# EAGLE design imp_rev1 (EAGLE 7.7.0)
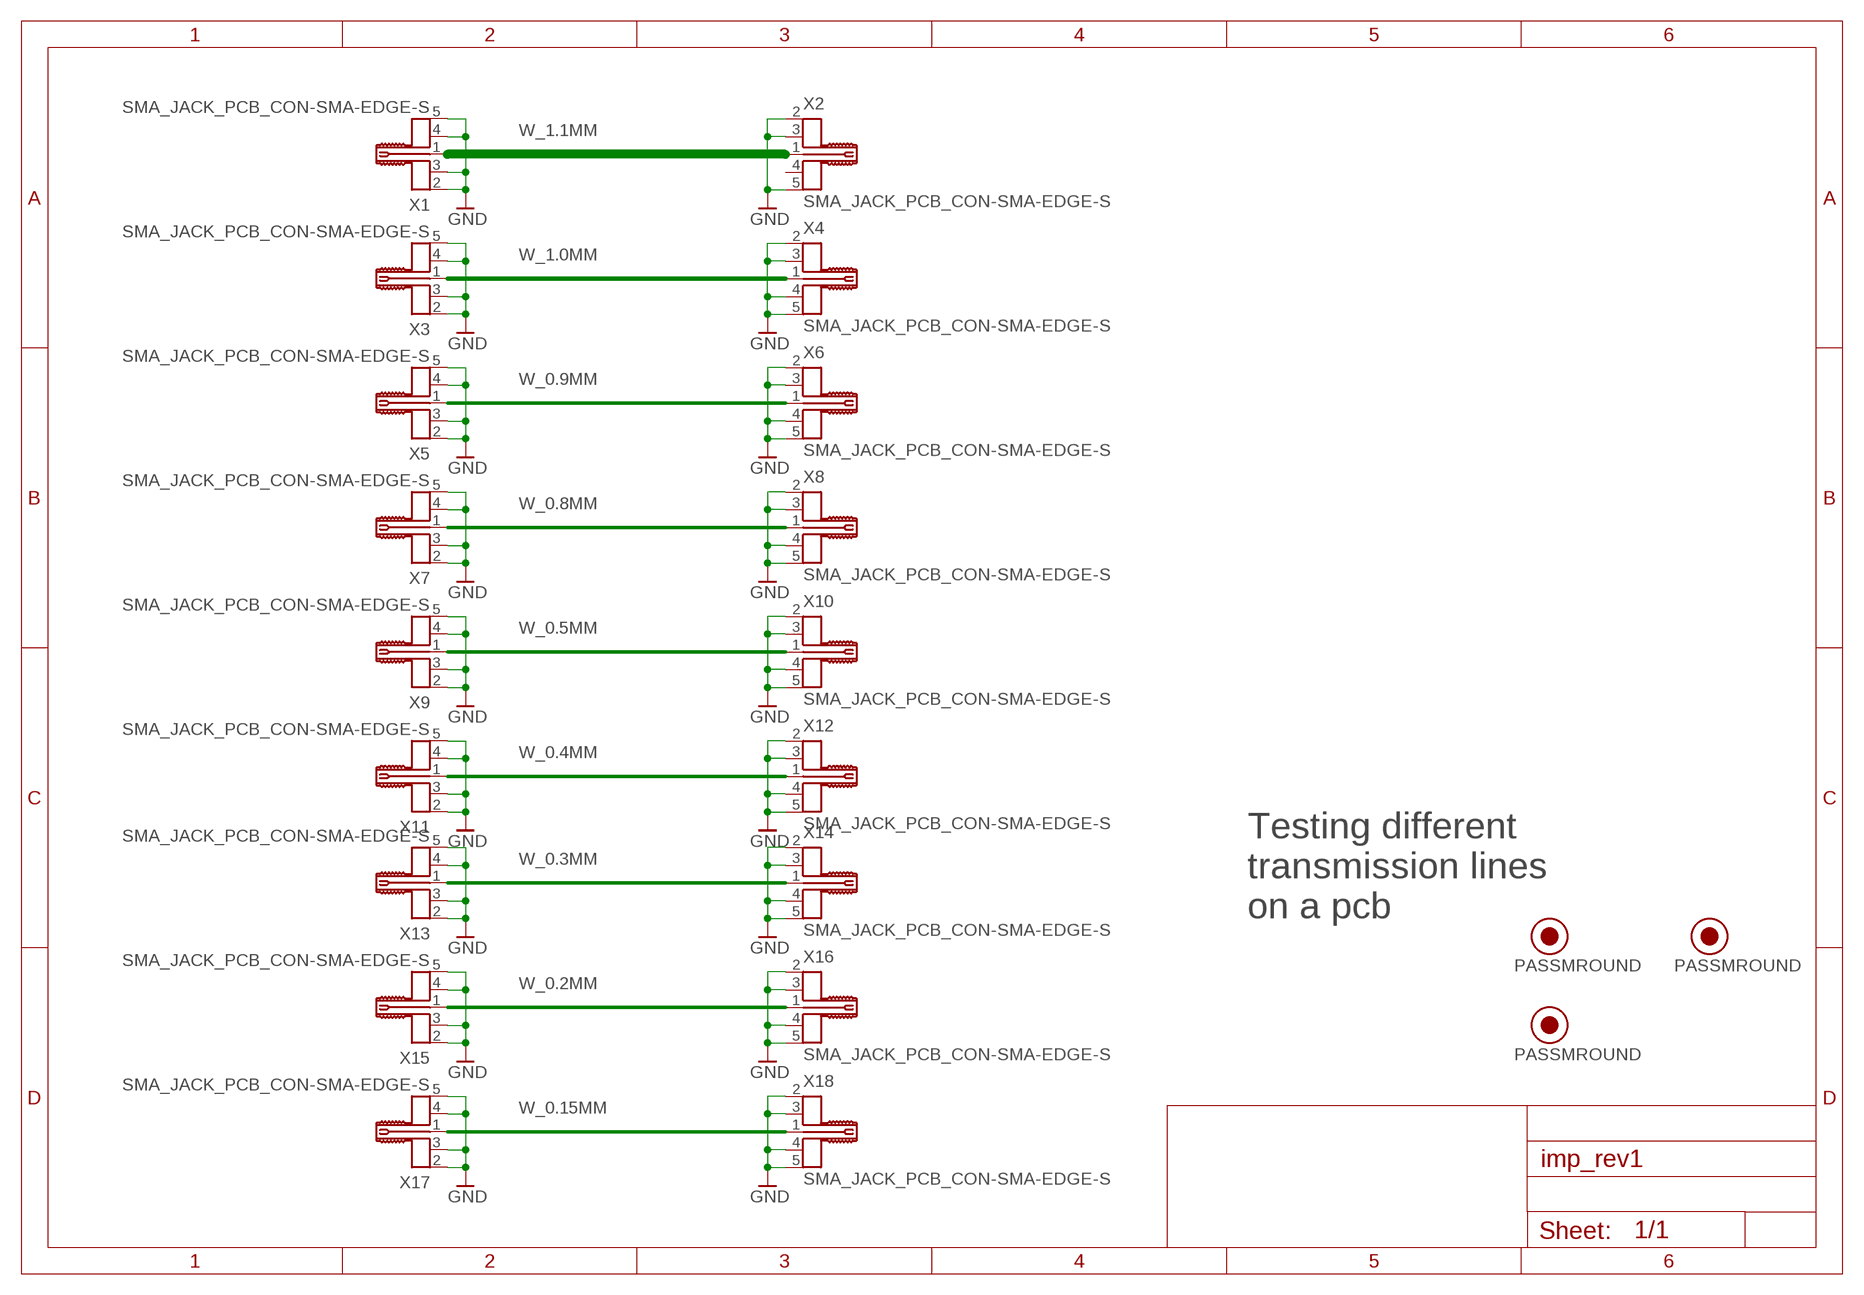
[diagram p0: schematic, sheet 1]

## Parts
P1  PASSMROUND  [PASSM]
P2  PASSMROUND  [PASSM]
P3  PASSMROUND  [PASSM]
X1  SMA_JACK_PCB_CON-SMA-EDGE-S  [SMA_JACK_PCB_CON-SMA-EDGE-S]
X2  SMA_JACK_PCB_CON-SMA-EDGE-S  [SMA_JACK_PCB_CON-SMA-EDGE-S]
X3  SMA_JACK_PCB_CON-SMA-EDGE-S  [SMA_JACK_PCB_CON-SMA-EDGE-S]
X4  SMA_JACK_PCB_CON-SMA-EDGE-S  [SMA_JACK_PCB_CON-SMA-EDGE-S]
X5  SMA_JACK_PCB_CON-SMA-EDGE-S  [SMA_JACK_PCB_CON-SMA-EDGE-S]
X6  SMA_JACK_PCB_CON-SMA-EDGE-S  [SMA_JACK_PCB_CON-SMA-EDGE-S]
X7  SMA_JACK_PCB_CON-SMA-EDGE-S  [SMA_JACK_PCB_CON-SMA-EDGE-S]
X8  SMA_JACK_PCB_CON-SMA-EDGE-S  [SMA_JACK_PCB_CON-SMA-EDGE-S]
X9  SMA_JACK_PCB_CON-SMA-EDGE-S  [SMA_JACK_PCB_CON-SMA-EDGE-S]
X10  SMA_JACK_PCB_CON-SMA-EDGE-S  [SMA_JACK_PCB_CON-SMA-EDGE-S]
X11  SMA_JACK_PCB_CON-SMA-EDGE-S  [SMA_JACK_PCB_CON-SMA-EDGE-S]
X12  SMA_JACK_PCB_CON-SMA-EDGE-S  [SMA_JACK_PCB_CON-SMA-EDGE-S]
X13  SMA_JACK_PCB_CON-SMA-EDGE-S  [SMA_JACK_PCB_CON-SMA-EDGE-S]
X14  SMA_JACK_PCB_CON-SMA-EDGE-S  [SMA_JACK_PCB_CON-SMA-EDGE-S]
X15  SMA_JACK_PCB_CON-SMA-EDGE-S  [SMA_JACK_PCB_CON-SMA-EDGE-S]
X16  SMA_JACK_PCB_CON-SMA-EDGE-S  [SMA_JACK_PCB_CON-SMA-EDGE-S]
X17  SMA_JACK_PCB_CON-SMA-EDGE-S  [SMA_JACK_PCB_CON-SMA-EDGE-S]
X18  SMA_JACK_PCB_CON-SMA-EDGE-S  [SMA_JACK_PCB_CON-SMA-EDGE-S]

## Nets
GND: X1.2(GND1) X1.3(GND2) X1.4(GND3) X1.5(GND4) X2.2(GND1) X2.3(GND2) X2.5(GND4) X3.2(GND1) X3.3(GND2) X3.4(GND3) X3.5(GND4) X4.2(GND1) X4.3(GND2) X4.4(GND3) X4.5(GND4) X5.2(GND1) X5.3(GND2) X5.4(GND3) X5.5(GND4) X6.2(GND1) X6.3(GND2) X6.4(GND3) X6.5(GND4) X7.2(GND1) X7.3(GND2) X7.4(GND3) X7.5(GND4) X8.2(GND1) X8.3(GND2) X8.4(GND3) X8.5(GND4) X9.2(GND1) X9.3(GND2) X9.4(GND3) X9.5(GND4) X10.2(GND1) X10.3(GND2) X10.4(GND3) X10.5(GND4) X11.2(GND1) X11.3(GND2) X11.4(GND3) X11.5(GND4) X12.2(GND1) X12.3(GND2) X12.4(GND3) X12.5(GND4) X13.2(GND1) X13.3(GND2) X13.4(GND3) X13.5(GND4) X14.2(GND1) X14.3(GND2) X14.4(GND3) X14.5(GND4) X15.2(GND1) X15.3(GND2) X15.4(GND3) X15.5(GND4) X16.2(GND1) X16.3(GND2) X16.4(GND3) X16.5(GND4) X17.2(GND1) X17.3(GND2) X17.4(GND3) X17.5(GND4) X18.2(GND1) X18.3(GND2) X18.4(GND3) X18.5(GND4)
W_0.2MM: X15.1 X16.1
W_0.3MM: X13.1 X14.1
W_0.4MM: X11.1 X12.1
W_0.5MM: X9.1 X10.1
W_0.8MM: X7.1 X8.1
W_0.9MM: X5.1 X6.1
W_0.15MM: X17.1 X18.1
W_1.0MM: X3.1 X4.1
W_1.1MM: X1.1 X2.1
Unconnected: X2.4(GND3)

## Notes on the sheet
- Testing different 
  transmission lines 
  on a pcb

## Library data of the parts
P1-P3 = general:PASSM
X1-X18 = general:SMA_JACK_PCB

## Board
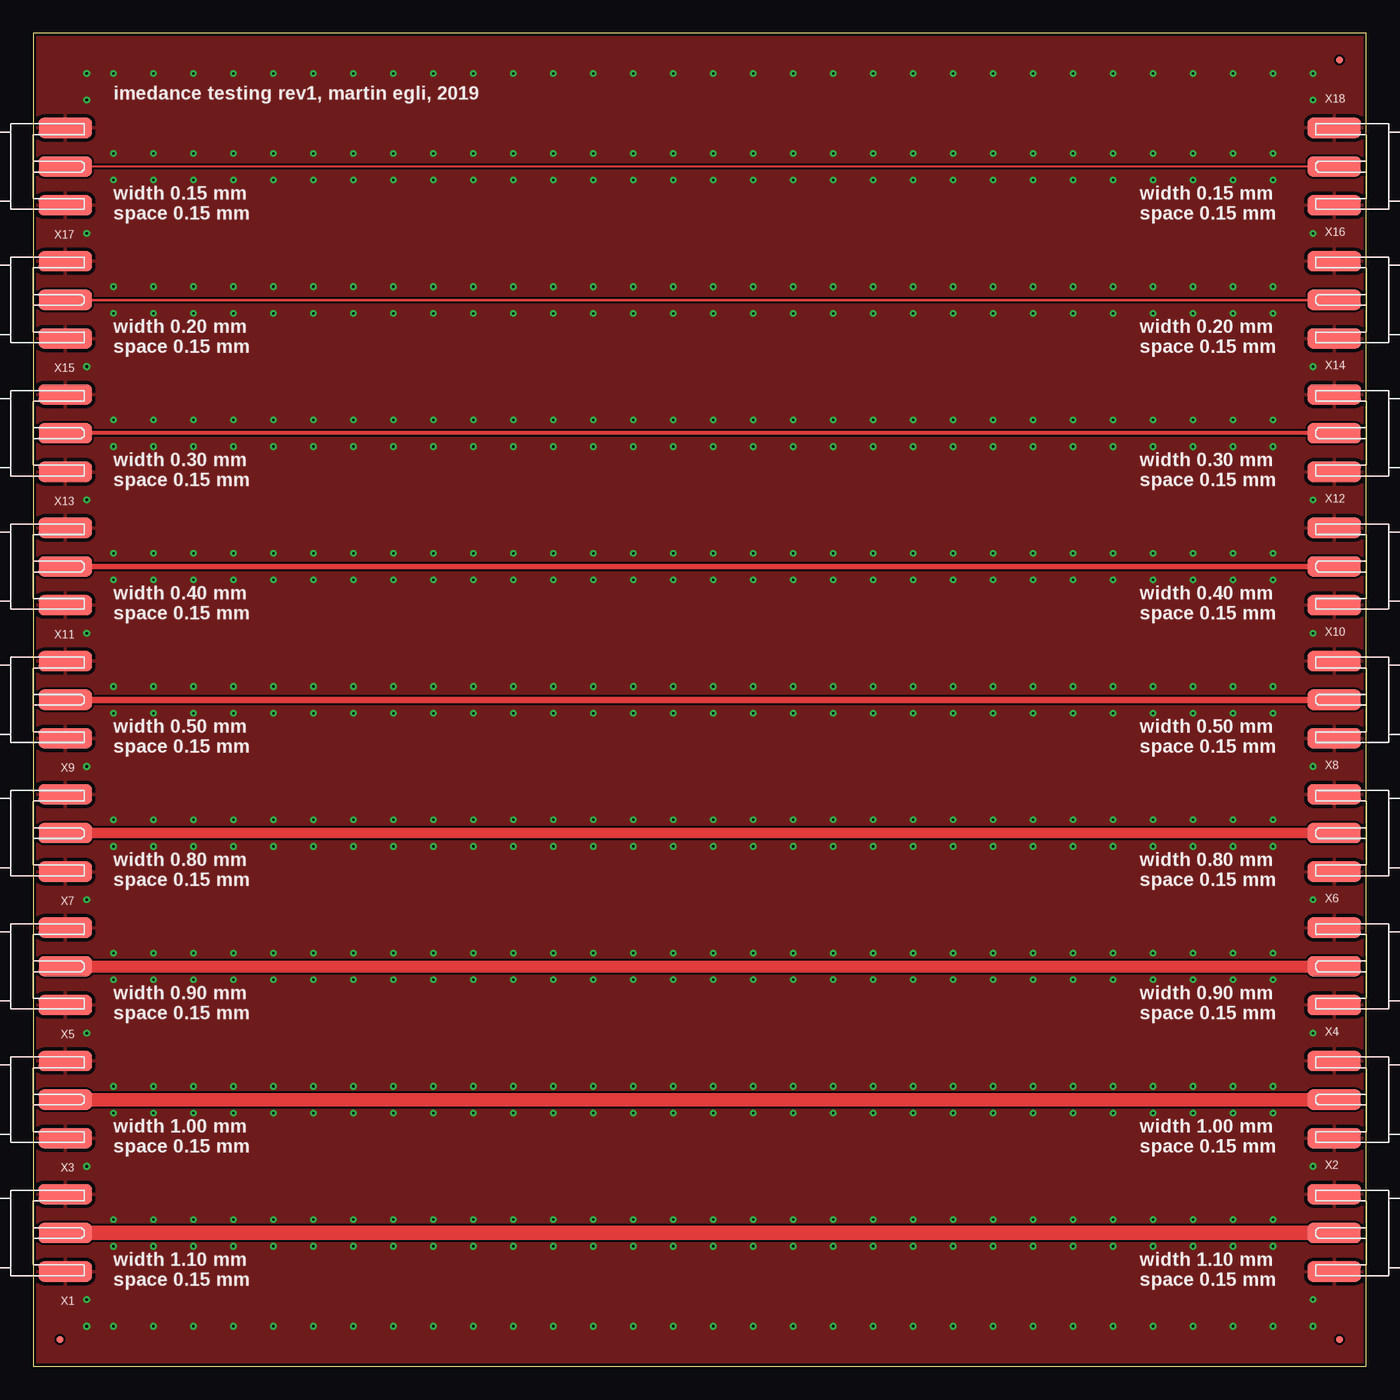
[diagram p1: board, top side]
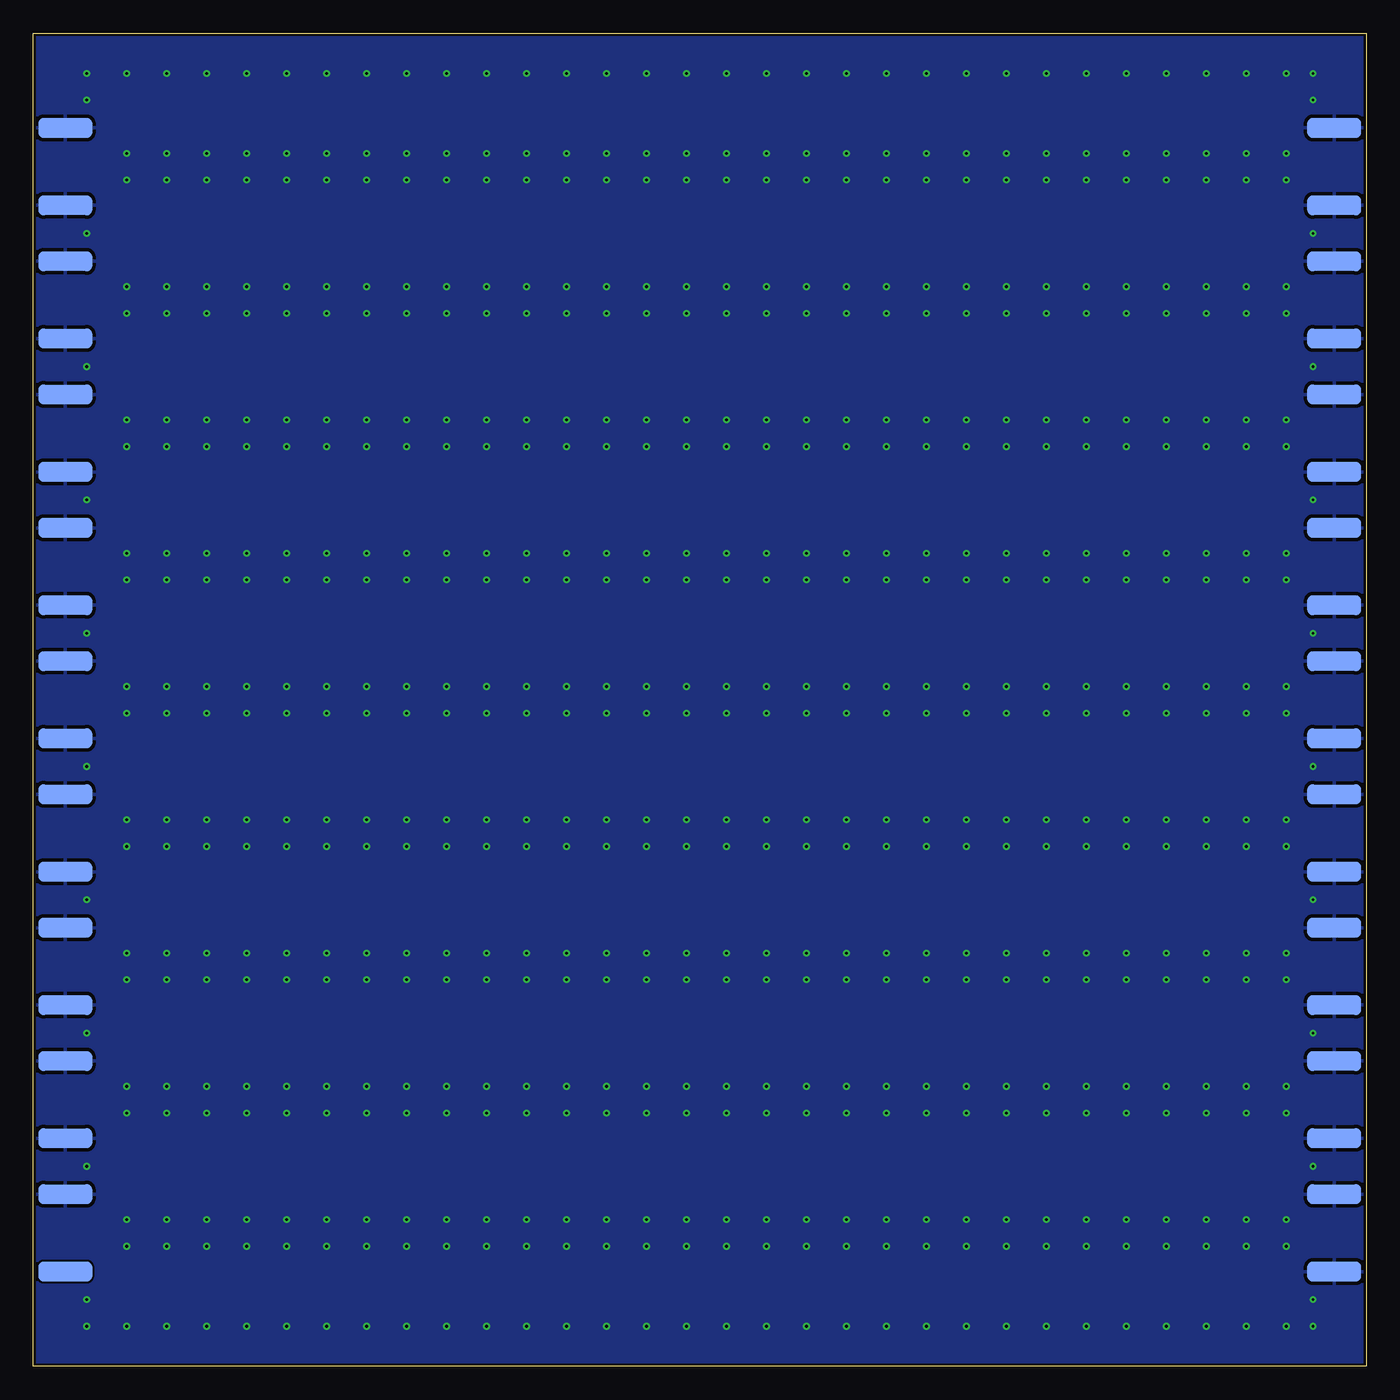
[diagram p2: board, bottom side, seen from below]

Size 100 x 100 mm. Coordinates in mm from the lower left corner, seen from the top.
Outline: 0,0 100,0 100,100 0,100 0,0
Copper layers (1*16): Top 0.035mm / dielectric 1.5mm / Bottom 0.035mm
Design rules "jlcpcb2layer *": minimum track width 5mil, minimum drill 0.2mm, track to track 5mil, track to pad 5mil, pad to pad 5mil, via to via 5mil, smd to smd 5mil, copper to edge 0.2mm, drill to drill 8mil, minimum pad ring 0.15mm, minimum via ring 0.15mm, stop-mask expansion 4mil, vias tented up to drill 0.2mm, thermal gap 10mil

### Footprints (pad centres in the part's own frame; a part is rotated, then mirrored left to right if it is on the bottom)
PASSM = smd 0.5 x 0.5: FIDUCIAL 0,0
SMA_JACK_PCB_CON-SMA-EDGE-S = smd 4 x 1.5: 1 -2.4,0; 2 -2.4,2.9; 3 -2.4,-2.9 | smd 4 x 1.5 bottom: 4 -2.4,-2.9; 5 -2.4,2.9

### Placement (x,y rotation side)
P1  2,2 0 top
P2  98,98 0 top
P3  98,2 0 top
X1  0,10 180 top
X2  100,10 0 top
X3  0,20 180 top
X4  100,20 0 top
X5  0,30 180 top
X6  100,30 0 top
X7  0,40 180 top
X8  100,40 0 top
X9  0,50 180 top
X10  100,50 0 top
X11  0,60 180 top
X12  100,60 0 top
X13  0,70 180 top
X14  100,70 0 top
X15  0,80 180 top
X16  100,80 0 top
X17  0,90 180 top
X18  100,90 0 top

### Tracks (layer width: path | path; a pad name or v marks a point on that pad's centre or on a via)
GND  (via drill 0.2)
  other vias: 6,9 9,9 12,9 15,9 18,9 21,9 24,9 27,9 30,9 33,9 36,9 39,9 42,9 45,9 48,9 51,9 54,9 57,9 60,9 63,9 66,9 69,9 72,9 75,9 78,9 81,9 84,9 87,9 90,9 93,9 6,11 9,11 12,11 15,11 18,11 21,11 24,11 27,11 30,11 33,11 36,11 39,11 42,11 45,11 48,11 51,11 54,11 57,11 60,11 63,11 66,11 69,11 72,11 75,11 78,11 81,11 84,11 87,11 90,11 93,11 6,19 9,19 12,19 15,19 18,19 21,19 24,19 27,19 30,19 33,19 36,19 39,19 42,19 45,19 48,19 51,19 54,19 57,19 60,19 63,19 66,19 69,19 72,19 75,19 78,19 81,19 84,19 87,19 90,19 93,19 6,21 9,21 12,21 15,21 18,21 21,21 24,21 27,21 30,21 33,21 36,21 39,21 42,21 45,21 48,21 51,21 54,21 57,21 60,21 63,21 66,21 69,21 72,21 75,21 78,21 81,21 84,21 87,21 90,21 93,21 6,91 9,91 12,91 15,91 18,91 21,91 24,91 27,91 30,91 33,91 36,91 39,91 42,91 45,91 48,91 51,91 54,91 57,91 60,91 63,91 66,91 69,91 72,91 75,91 78,91 81,91 84,91 87,91 90,91 93,91 6,89 9,89 12,89 15,89 18,89 21,89 24,89 27,89 30,89 33,89 36,89 39,89 42,89 45,89 48,89 51,89 54,89 57,89 60,89 63,89 66,89 69,89 72,89 75,89 78,89 81,89 84,89 87,89 90,89 93,89 6,81 9,81 12,81 15,81 18,81 21,81 24,81 27,81 30,81 33,81 36,81 39,81 42,81 45,81 48,81 51,81 54,81 57,81 60,81 63,81 66,81 69,81 72,81 75,81 78,81 81,81 84,81 87,81 90,81 93,81 6,79 9,79 12,79 15,79 18,79 21,79 24,79 27,79 30,79 33,79 36,79 39,79 42,79 45,79 48,79 51,79 54,79 57,79 60,79 63,79 66,79 69,79 72,79 75,79 78,79 81,79 84,79 87,79 90,79 93,79 6,71 9,71 12,71 15,71 18,71 21,71 24,71 27,71 30,71 33,71 36,71 39,71 42,71 45,71 48,71 51,71 54,71 57,71 60,71 63,71 66,71 69,71 72,71 75,71 78,71 81,71 84,71 87,71 90,71 93,71 6,69 9,69 12,69 15,69 18,69 21,69 24,69 27,69 30,69 33,69 36,69 39,69 42,69 45,69 48,69 51,69 54,69 57,69 60,69 63,69 66,69 69,69 72,69 75,69 78,69 81,69 84,69 87,69 90,69 93,69 6,61 9,61 12,61 15,61 18,61 21,61 24,61 27,61 30,61 33,61 36,61 39,61 42,61 45,61 48,61 51,61 54,61 57,61 60,61 63,61 66,61 69,61 72,61 75,61 78,61 81,61 84,61 87,61 90,61 93,61 6,59 9,59 12,59 15,59 18,59 21,59 24,59 27,59 30,59 33,59 36,59 39,59 42,59 45,59 48,59 51,59 54,59 57,59 60,59 63,59 66,59 69,59 72,59 75,59 78,59 81,59 84,59 87,59 90,59 93,59 6,51 9,51 12,51 15,51 18,51 21,51 24,51 27,51 30,51 33,51 36,51 39,51 42,51 45,51 48,51 51,51 54,51 57,51 60,51 63,51 66,51 69,51 72,51 75,51 78,51 81,51 84,51 87,51 90,51 93,51 6,49 9,49 12,49 15,49 18,49 21,49 24,49 27,49 30,49 33,49 36,49 39,49 42,49 45,49 48,49 51,49 54,49 57,49 60,49 63,49 66,49 69,49 72,49 75,49 78,49 81,49 84,49 87,49 90,49 93,49 6,41 9,41 12,41 15,41 18,41 21,41 24,41 27,41 30,41 33,41 36,41 39,41 42,41 45,41 48,41 51,41 54,41 57,41 60,41 63,41 66,41 69,41 72,41 75,41 78,41 81,41 84,41 87,41 90,41 93,41 6,39 9,39 12,39 15,39 18,39 21,39 24,39 27,39 30,39 33,39 36,39 39,39 42,39 45,39 48,39 51,39 54,39 57,39 60,39 63,39 66,39 69,39 72,39 75,39 78,39 81,39 84,39 87,39 90,39 93,39 6,31 9,31 12,31 15,31 18,31 21,31 24,31 27,31 30,31 33,31 36,31 39,31 42,31 45,31 48,31 51,31 54,31 57,31 60,31 63,31 66,31 69,31 72,31 75,31 78,31 81,31 84,31 87,31 90,31 93,31 6,29 9,29 12,29 15,29 18,29 21,29 24,29 27,29 30,29 33,29 36,29 39,29 42,29 45,29 48,29 51,29 54,29 57,29 60,29 63,29 66,29 69,29 72,29 75,29 78,29 81,29 84,29 87,29 90,29 93,29 4,15 4,25 4,35 4,45 4,55 4,65 4,75 4,85 96,85 96,75 96,65 96,55 96,45 96,35 96,25 96,15 96,5 96,3 96,95 96,97 4,95 4,97 4,5 4,3 93,3 90,3 87,3 84,3 81,3 78,3 75,3 72,3 69,3 66,3 63,3 60,3 57,3 54,3 51,3 48,3 45,3 42,3 39,3 36,3 33,3 30,3 27,3 24,3 21,3 18,3 15,3 12,3 9,3 6,3 93,97 90,97 87,97 84,97 81,97 78,97 75,97 72,97 69,97 66,97 63,97 60,97 57,97 54,97 51,97 48,97 45,97 42,97 39,97 36,97 33,97 30,97 27,97 24,97 21,97 18,97 15,97 12,97 9,97 6,97
  pour Top (isolate 0.15): 0,100 100,100 100,0 0,0
  pour Bottom (isolate 0.15): 0,100 100,100 100,0 0,0
W_0.2MM
  Top 0.2: X15.1 X16.1
W_0.3MM
  Top 0.3: X14.1 X13.1
W_0.4MM
  Top 0.4: X11.1 X12.1
W_0.5MM
  Top 0.5: X10.1 X9.1
W_0.8MM
  Top 0.8: X7.1 X8.1
W_0.9MM
  Top 0.9: X5.1 X6.1
W_0.15MM
  Top 0.15: X18.1 X17.1
W_1.0MM
  Top 1: X4.1 X3.1
W_1.1MM
  Top 1.1: X1.1 X2.1

### Text on the board
tPlace: imedance testing rev1, martin egli, 2019 | width 0.15 mm / space 0.15 mm | width 0.15 mm / space 0.15 mm | width 0.20 mm / space 0.15 mm | width 0.20 mm / space 0.15 mm | width 0.30 mm / space 0.15 mm | width 0.30 mm / space 0.15 mm | width 0.40 mm / space 0.15 mm | width 0.40 mm / space 0.15 mm | width 0.50 mm / space 0.15 mm | width 0.50 mm / space 0.15 mm | width 0.80 mm / space 0.15 mm | width 0.80 mm / space 0.15 mm | width 0.90 mm / space 0.15 mm | width 0.90 mm / space 0.15 mm | width 1.00 mm / space 0.15 mm | width 1.00 mm / space 0.15 mm | width 1.10 mm / space 0.15 mm | width 1.10 mm / space 0.15 mm